# Altium schematic sheet microsd.SchDoc
size A
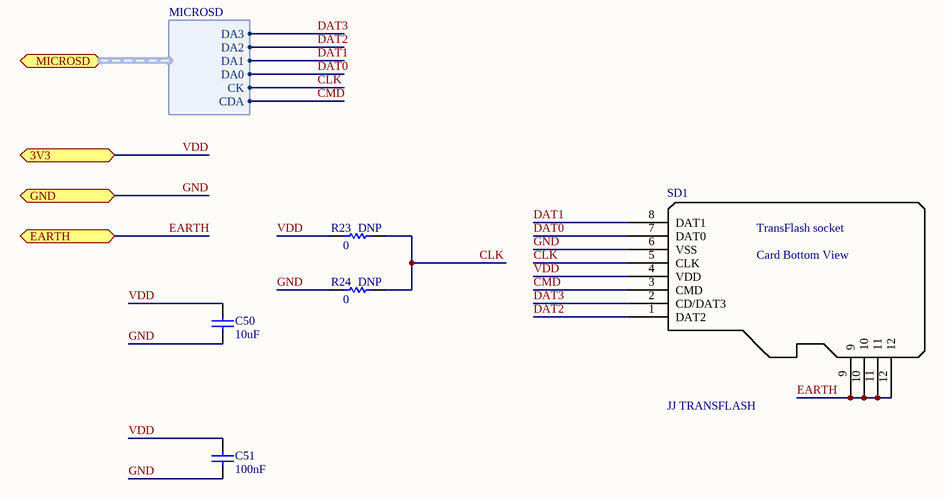
[diagram p0: microsd.SchDoc]

## Parts
C50  value 10uF  [0805]  (hidden comment: CAP)
C51  value 100nF  [0805]  (hidden comment: CAP)
R23  value 0  Do Not Place: DNP  [0805]  (hidden comment: RES 0 Ohm)
R24  value 0  Do Not Place: DNP  [0805]  (hidden comment: RES 0 Ohm)
SD1  JJ TRANSFLASH  [microSD Socket]

## Ports
3V3, EARTH, GND, MICROSD (harness MICROSD)

## Harnesses
MICROSD: CDA, CK, DA0, DA1, DA2, DA3

## Nets
CLK: R23.2 R24.2 SD1.5(CLK) ; port MICROSD.CK
CMD: SD1.3(CMD) ; port MICROSD.CDA
DAT0: SD1.7(DAT0) ; port MICROSD.DA0
DAT1: SD1.8(DAT1) ; port MICROSD.DA1
DAT2: SD1.1(DAT2) ; port MICROSD.DA2
DAT3: SD1.2(CD/DAT3) ; port MICROSD.DA3
EARTH: SD1.9 SD1.10 SD1.11 SD1.12 ; port EARTH
GND: C50.1 C51.1 R24.1 SD1.6(VSS) ; port GND
VDD: C50.2 C51.2 R23.1 SD1.4(VDD) ; port 3V3

## Notes on the sheet
- (in symbol JJ TRANSFLASH) TransFlash socket; Card Bottom View

## Library data of the parts
C50 C51 = CAP: Tolerance: 5%; Voltage: 25V; Manufacturer: *; Manufacturer P/N: *; Tr: *; Distributor: Digi-Key; Distributor P/N: *
R23 R24 = RES 0805 0.0 Ohm .33W: Manufacturer: Vishay Dale; Manufacturer P/N: CRCW08050000Z0EAHP; Tcr: *; Tolerance: 0; Tr: *; Alternatives: *; Voltage: *; Power: .33W; Distributor: Digi-Key; Distributor P/N: 541-0.0TBCT-ND
SD1 = JJ TRANSFLASH: Transflash Socket; Distributor: Acme Systems; Distributor P/N: MSD-HOLDER-1; Manufacturer: *; Manufacturer P/N: *